# Altium schematic sheet ESP.SchDoc
size A
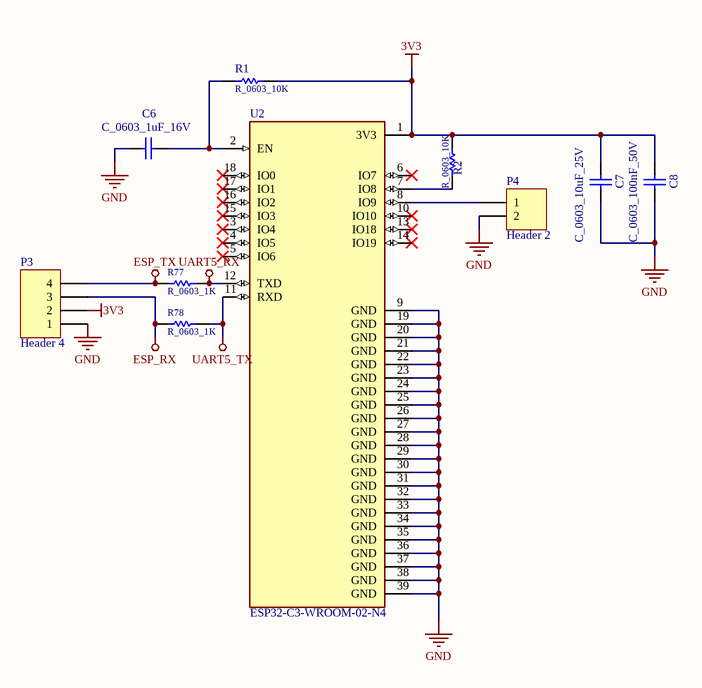
[diagram p0: ESP.SchDoc]

## Parts
C6  C_0603_1uF_16V  [CAP 0603]
C7  C_0603_10uF_25V  [CAP 0603]
C8  C_0603_100nF_50V  [CAP 0603]
P3  Header 4  [HDR1X4]
P4  Header 2  [HDR1X2]
R1  R_0603_10K  [RES 0603]
R2  R_0603_10K  [RES 0603]
R77  R_0603_1K  [RES 0603]
R78  R_0603_1K  [RES 0603]
U2  ESP32-C3-WROOM-02-N4  [ESP32-C3-WROOM-02-H4]

## Nets
3V3: C7.2 C8.2 P3.2 R1.1 R2.1 U2.1(3V3)
ESP_RX: P3.3 R78.2
ESP_TX: P3.4 R77.2
GND: C6.2 C7.1 C8.1 P3.1 P4.2 U2.9(GND) U2.19(GND) U2.20(GND) U2.21(GND) U2.22(GND) U2.23(GND) U2.24(GND) U2.25(GND) U2.26(GND) U2.27(GND) U2.28(GND) U2.29(GND) U2.30(GND) U2.31(GND) U2.32(GND) U2.33(GND) U2.34(GND) U2.35(GND) U2.36(GND) U2.37(GND) U2.38(GND) U2.39(GND)
UART5_RX: R77.1 U2.12(TXD)
UART5_TX: R78.1 U2.11(RXD)
NetC6_1: C6.1 R1.2 U2.2(EN)
NetP4_1: P4.1 U2.8(IO9)
NetR2_2: R2.2 U2.7(IO8)

Not connected (* = marked no-connect by the designer): U2 3(IO4)* 4(IO5)* 5(IO6)* 6(IO7)* 10(IO10)* 13(IO18)* 14(IO19)* 15(IO3)* 16(IO2)* 17(IO1)* 18(IO0)*

## Library data of the parts
C6-C8 = Cap: Capacitor; Published: 8-Jun-2000; LatestRevisionDate: 17-Jul-2002; LatestRevisionNote: Re-released for DXP Platform.; Publisher: Altium Limited
P3 = Header 4: Header, 4-Pin; LatestRevisionDate: 17-Jul-2002; LatestRevisionNote: Re-released for DXP Platform.; Publisher: Altium Limited
P4 = Header 2: Header, 2-Pin; LatestRevisionDate: 17-Jul-2002; LatestRevisionNote: Re-released for DXP Platform.; Publisher: Altium Limited
R1 R2 R77 R78 = Res: Resistor; Published: 8-Jun-2000; LatestRevisionDate: 17-Jul-2002; LatestRevisionNote: Re-released for DXP Platform.; Publisher: Altium Limited
U2 = ESP32-C3-WROOM-02-N4: WiFi Modules (802.11) (Engineering Samples) SMD module, ESP32-C3, 4MB SPI flash, PCB antenna, -40 C +85 C; MF: Espressif Systems; Value: *; SnapEDA_Link: https://www.snapeda.com/parts/ESP32-C3-WROOM-02-N4/Espressif+Systems/view-part/?ref=snap; Purchase-URL: https://pricing.snapeda.com/search/part/ESP32-C3-WROOM-02-N4/?ref=eda; Availability: In Stock; Price: None; Package: Package; Check_prices: https://www.snapeda.com/parts/ESP32-C3-WROOM-02-N4/Espressif+Systems/view-part/?ref=eda; MP: ESP32-C3-WROOM-02-N4